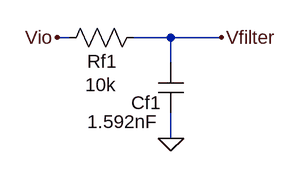
[diagram p0: schematic rcfilter.asc]
rcfilter.asc, the LTspice schematic file:
Version 4
SHEET 1 880 680
WIRE -16 16 -32 16
WIRE 112 16 64 16
WIRE 176 16 112 16
WIRE 112 48 112 16
WIRE 112 144 112 112
FLAG -32 16 Vio
FLAG 112 144 0
FLAG 176 16 Vfilter
SYMBOL res 80 0 R90
WINDOW 0 62 55 VBottom 2
WINDOW 3 61 57 VTop 2
SYMATTR InstName Rf1
SYMATTR Value 10k
SYMBOL cap 128 112 R180
WINDOW 0 29 13 Left 2
WINDOW 3 33 -11 Left 2
SYMATTR InstName Cf1
SYMATTR Value 1.592nF

The netlist it stands for:
* rcfilter.asc
Rf1 Vfilter Vio 10k
Cf1 0 Vfilter 1.592nF
.backanno
.end